# EAGLE schematic Lenovo_Scanner (EAGLE 9.2.2)
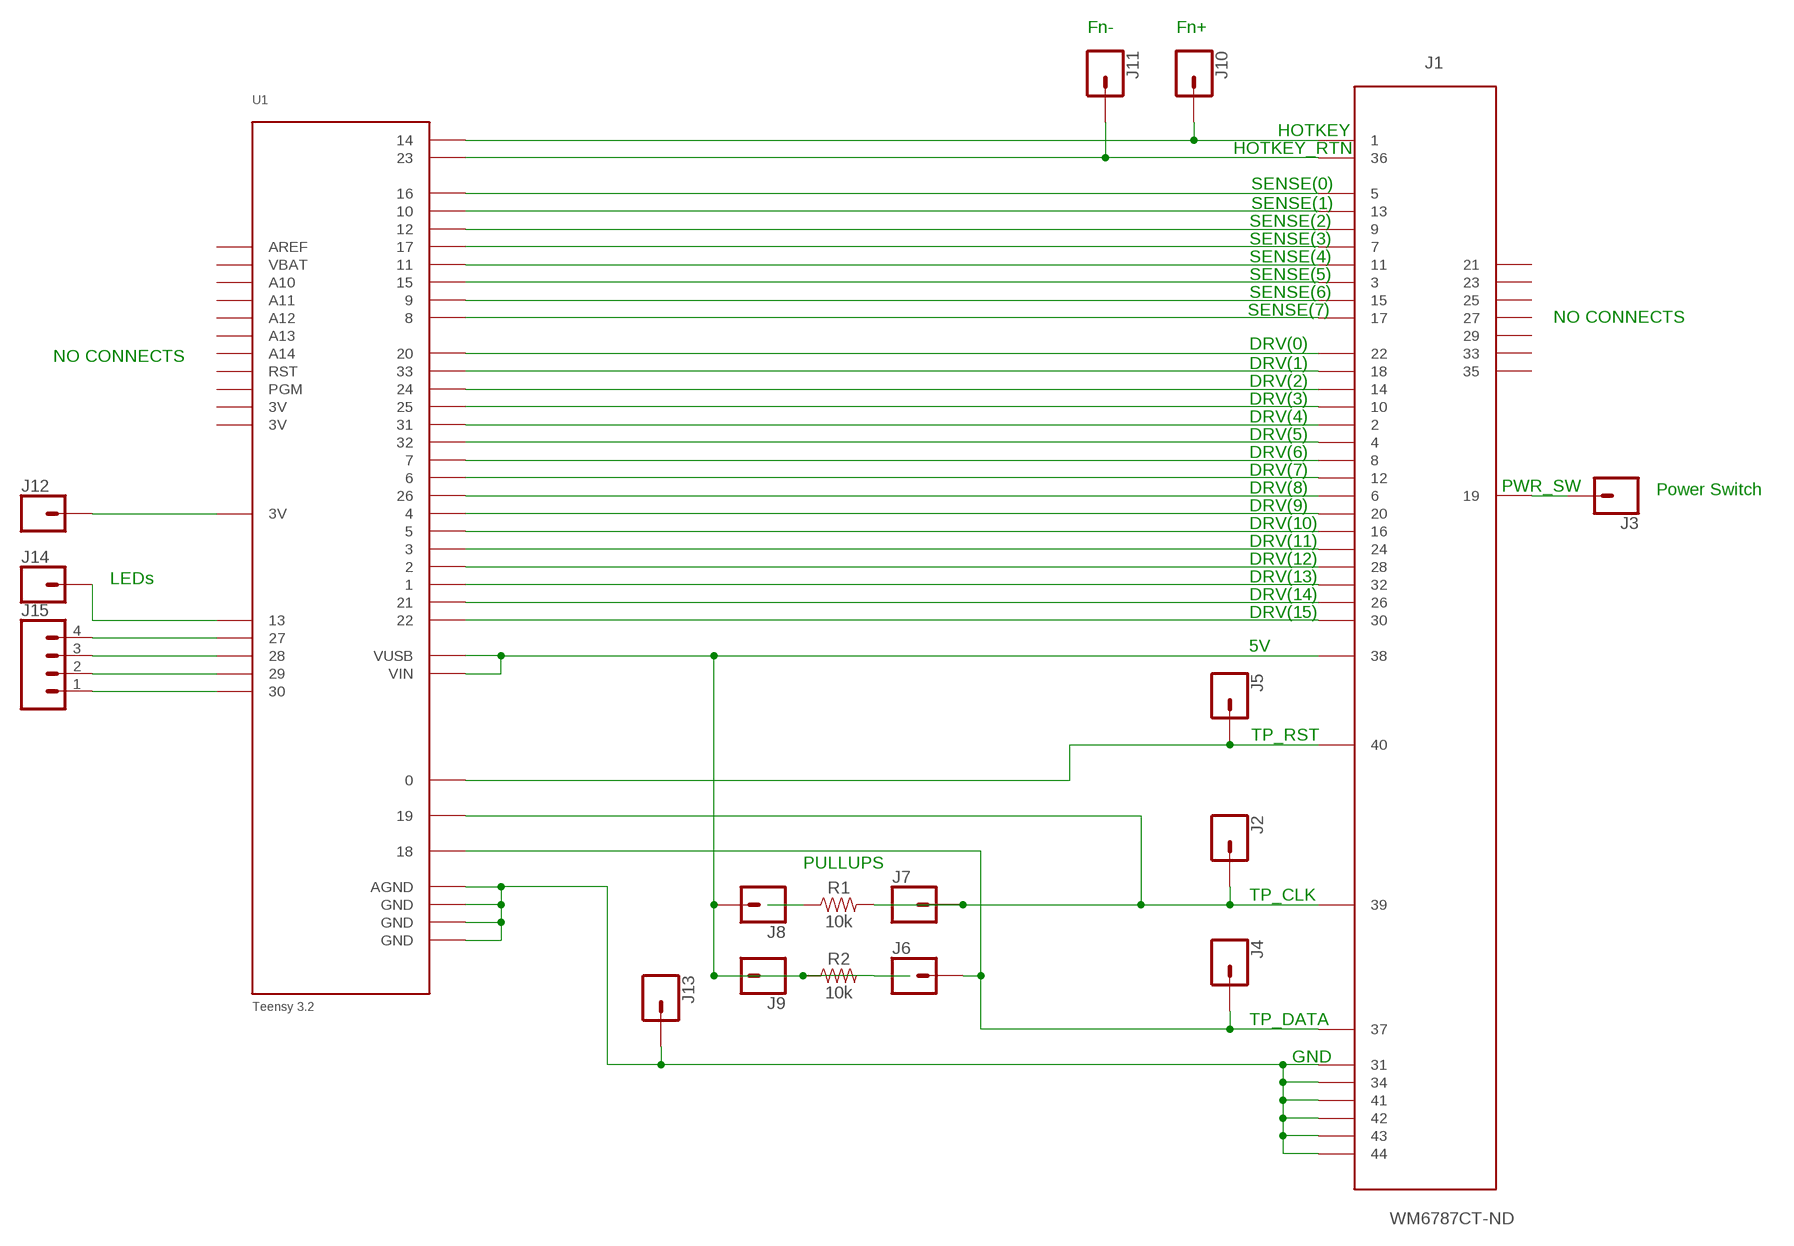
[diagram p0: schematic, sheet 1]

## Parts
J1  WM6787CT-ND  [WM6787CT-ND]
J2  CONN_01  [1X01]
J3  CONN_01  [1X01]
J4  CONN_01  [1X01]
J5  CONN_01  [1X01]
J6  CONN_01  [1X01]
J7  CONN_01  [1X01]
J8  CONN_01  [1X01]
J9  CONN_01  [1X01]
J10  CONN_01  [1X01]
J11  CONN_01  [1X01]
J12  CONN_01  [1X01]
J13  CONN_01  [1X01]
J14  CONN_01  [1X01]
J15  CONN_04  [1X04]
R1  10k  10KOHM-HORIZ-1/4W-5%  [AXIAL-0.3]
R2  10k  10KOHM-HORIZ-1/4W-5%  [AXIAL-0.3]
U1  Teensy 3.2  TEENSY_3P2  [TEENSY_3P2]

## Nets
5V: J1.P$38 J8.1 J9.1 R2.P$1 R2.P$2 U1.VIN U1.VUSB
DRV(9): J1.P$20 U1.4
GND: J1.P$31 J1.P$34 J1.P$41 J1.P$42 J1.P$43 J1.P$44 J13.1 U1.AGND U1.GND1(GND) U1.GND2(GND) U1.GND3(GND)
N$1: J1.P$5 U1.16
N$2: J1.P$13 U1.10
N$3: J1.P$9 U1.12
N$4: J1.P$7 U1.17
N$5: J1.P$3 U1.15
N$6: J1.P$15 U1.9
N$7: J1.P$17 U1.8
N$8: J1.P$22 U1.20
N$9: J1.P$18 U1.33
N$10: J1.P$14 U1.24
N$11: J1.P$10 U1.25
N$12: J1.P$2 U1.31
N$13: J1.P$4 U1.32
N$14: J1.P$8 U1.7
N$15: J1.P$12 U1.6
N$16: J1.P$6 U1.26
N$17: J1.P$16 U1.5
N$18: J1.P$24 U1.3
N$19: J1.P$28 U1.2
N$20: J1.P$32 U1.1
N$21: J1.P$26 U1.21
N$22: J1.P$30 U1.22
N$23: J1.P$1 J10.1 U1.14
N$24: J1.P$36 J11.1 U1.23
N$25: J1.P$40 J5.1 U1.0
N$26: J14.1 U1.13
N$27: J15.4 U1.27
N$28: J15.3 U1.28
N$29: J12.1 U1.3V1(3V)
N$30: J15.2 U1.29
N$31: J15.1 U1.30
N$32: R1.P$1
PWR_SW: J1.P$19 J3.1
SENSE(4): J1.P$11 U1.11
TP_CLK: J1.P$39 J2.1 J7.1 R1.P$2 U1.19
TP_DATA: J1.P$37 J4.1 J6.1 U1.18
Unconnected: J1.P$21 J1.P$23 J1.P$25 J1.P$27 J1.P$29 J1.P$33 J1.P$35 U1.A10 U1.A11 U1.A12 U1.A13 U1.A14 U1.PGM U1.RST

## Notes on the sheet
- Fn- | Fn+
- HOTKEY
- HOTKEY_RTN
- SENSE(0)
- SENSE(1)
- SENSE(2)
- SENSE(3)
- SENSE(4)
- SENSE(5)
- SENSE(6)
- SENSE(7)
- NO CONNECTS
- DRV(0)
- NO CONNECTS
- DRV(1)
- DRV(2)
- DRV(3)
- DRV(4)
- DRV(5)
- DRV(6)
- DRV(7)
- DRV(8) | PWR_SW | Power Switch
- DRV(9)
- DRV(10)
- DRV(11)
- DRV(12)
- LEDs | DRV(13)
- DRV(14)
- DRV(15)
- 5V
- TP_RST
- PULLUPS
- TP_CLK
- TP_DATA
- GND

## Power pins joined to a net without a drawn wire
3V: U1.3V2(3V) U1.3V3(3V)
AREF: U1.AREF
VBAT: U1.VBAT

## Library data of the parts
J1 = WM6787CT-ND:WM6787CT-ND: WM6787CT-ND - Motherboard keyboard connector Digikey part number WM6787CT-ND Molex part number 0543630489 Technical Specifications: 40 signal pins, odds on top, evens on bottom Pin Pitch is 0.5mm 4 additional ground pins on the corners
J2-J14 = SparkFun-Connectors:CONN_01: Single connection point. Often used as Generic Header-pin footprint for 0.1 inch spaced/style header connections On any of the 0.1 inch spaced packages, you can populate with these: Break Away Headers - Straight <https://www.sparkfun.com/products/116> (PRT-00116) Break Away Male Headers - Right Angle <https://www.sparkfun.com/products/553> (PRT-00553) Female Headers <https://www.sparkfun.com/products/115> (PRT-00115) Break Away Headers - Machine Pin <https://www.sparkfun.com/products/117> (PRT-00117) Break Away Female Headers - Swiss Machine Pin <https://www.sparkfun.com/products/743> (PRT-00743) This device is also useful as a general connection point to wire up your design to another part of your project. Our various solder wires solder well into these plated through hole pads. Hook-Up Wire - Assortment (Stranded, 22 AWG) <https://www.sparkfun.com/products/11375> (PRT-11375) Hook-Up Wire - Assortment (Solid Core, 22 AWG) <https://www.sparkfun.com/products/11367> (PRT-11367) View the entire wire category on our website here <https://www.sparkfun.com/categories/141> Special notes: SMTSO-256-ET is a "flush mount" nut for a 4-40 screw. We mostly use this on specialty testbeds; it is a nice way to connect hardware to your PCB at an adjustable hieght. Also note, the SNAP packages are for using a snappable style connector. We sell a baggie of snaps and they are also used on two LilyPad designs: Snap Assortment - 30 pack (male and female) <https://www.sparkfun.com/products/11347> (DEV-11347) LilyPad Arduino SimpleSnap <https://www.sparkfun.com/products/10941> (DEV-10941) LilyPad SimpleSnap Protoboard <https://www.sparkfun.com/products/10940> (DEV-10940)
J15 = SparkFun-Connectors:CONN_04: Multi connection point. Often used as Generic Header-pin footprint for 0.1 inch spaced/style header connections On any of the 0.1 inch spaced packages, you can populate with these: Break Away Headers - Straight <https://www.sparkfun.com/products/116> (PRT-00116) Break Away Male Headers - Right Angle <https://www.sparkfun.com/products/553> (PRT-00553) Female Headers <https://www.sparkfun.com/products/115> (PRT-00115) Break Away Headers - Machine Pin <https://www.sparkfun.com/products/117> (PRT-00117) Break Away Female Headers - Swiss Machine Pin <https://www.sparkfun.com/products/743> (PRT-00743) For SCREWTERMINALS and SPRING TERMINALS visit here: Screw Terimnals on SparkFun.com <https://www.sparkfun.com/search/results?term=Screw+Terminals> (5mm/3.5mm/2.54mm spacing) This device is also useful as a general connection point to wire up your design to another part of your project. Our various solder wires solder well into these plated through hole pads. Hook-Up Wire - Assortment (Stranded, 22 AWG) <https://www.sparkfun.com/products/11375> (PRT-11375) Hook-Up Wire - Assortment (Solid Core, 22 AWG) <https://www.sparkfun.com/products/11367> (PRT-11367) View the entire wire category on our website here <https://www.sparkfun.com/categories/141> Special notes: Molex polarized connector foot print use with SKU : PRT-08231 with associated crimp pins and housings. 1MM SMD Version SKU: PRT-10208; PROD_ID: CONN-09696
R1 R2 = SparkFun-Resistors:10KOHM: 10kΩ resistor A resistor is a passive two-terminal electrical component that implements electrical resistance as a circuit element. Resistors act to reduce current flow, and, at the same time, act to lower voltage levels within circuits. - Wikipedia; PROD_ID: RES-09435
U1 = Teensy_3p2:TEENSY_3P2: Teensy 3.2 - Microcontroller Technical Specifications: VCC: 3.3V signals, 5V tolerant 72 MHz Cortex-M4 32 bit ARM Processor 100% Compatible with Teensy 3.1 pjrc.com/store/teensy32.html